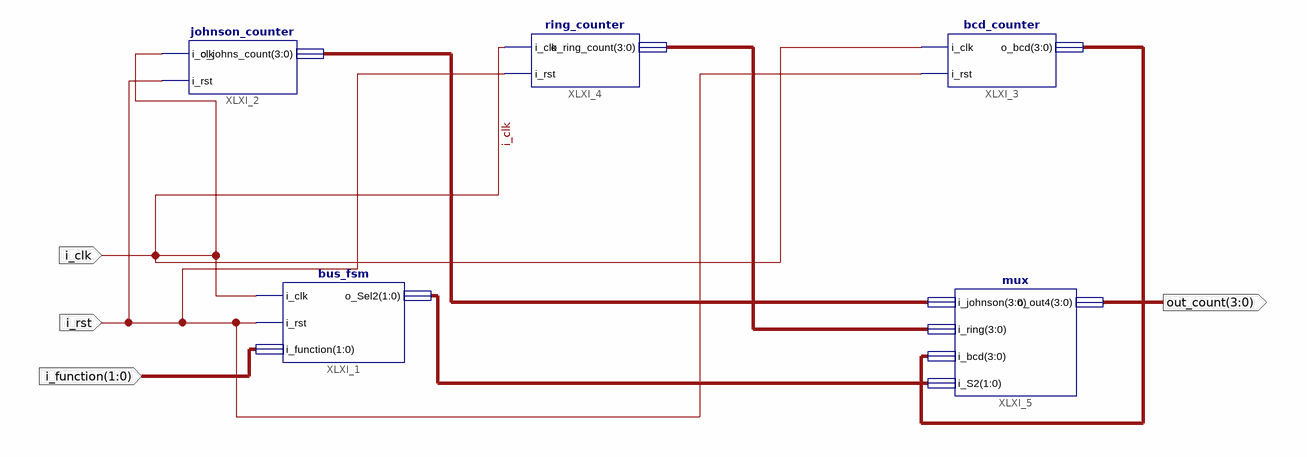
[diagram p0: schematic sheet 1]
// Xilinx ISE schematic counters_shared_bus.sch (spartan3e) as structural Verilog: 5 symbols, 4 ports
module counters_shared_bus (
  input  i_clk,
  input  i_rst,
  input  [1:0] i_function,
  output [3:0] out_count
);

  wire [1:0] XLXN_1;
  wire [3:0] XLXN_2, XLXN_3, XLXN_4;

  bus_fsm XLXI_1 (.i_clk(i_clk), .i_rst(i_rst), .i_function(i_function), .o_Sel2(XLXN_1));
  johnson_counter XLXI_2 (.i_clk(i_clk), .i_rst(i_rst), .o_johns_count(XLXN_2));
  bcd_counter XLXI_3 (.i_clk(i_clk), .i_rst(i_rst), .o_bcd(XLXN_4));
  ring_counter XLXI_4 (.i_clk(i_clk), .i_rst(i_rst), .o_ring_count(XLXN_3));
  mux XLXI_5 (.i_johnson(XLXN_2), .i_ring(XLXN_3), .i_bcd(XLXN_4), .i_S2(XLXN_1), .o_out4(out_count));
endmodule
